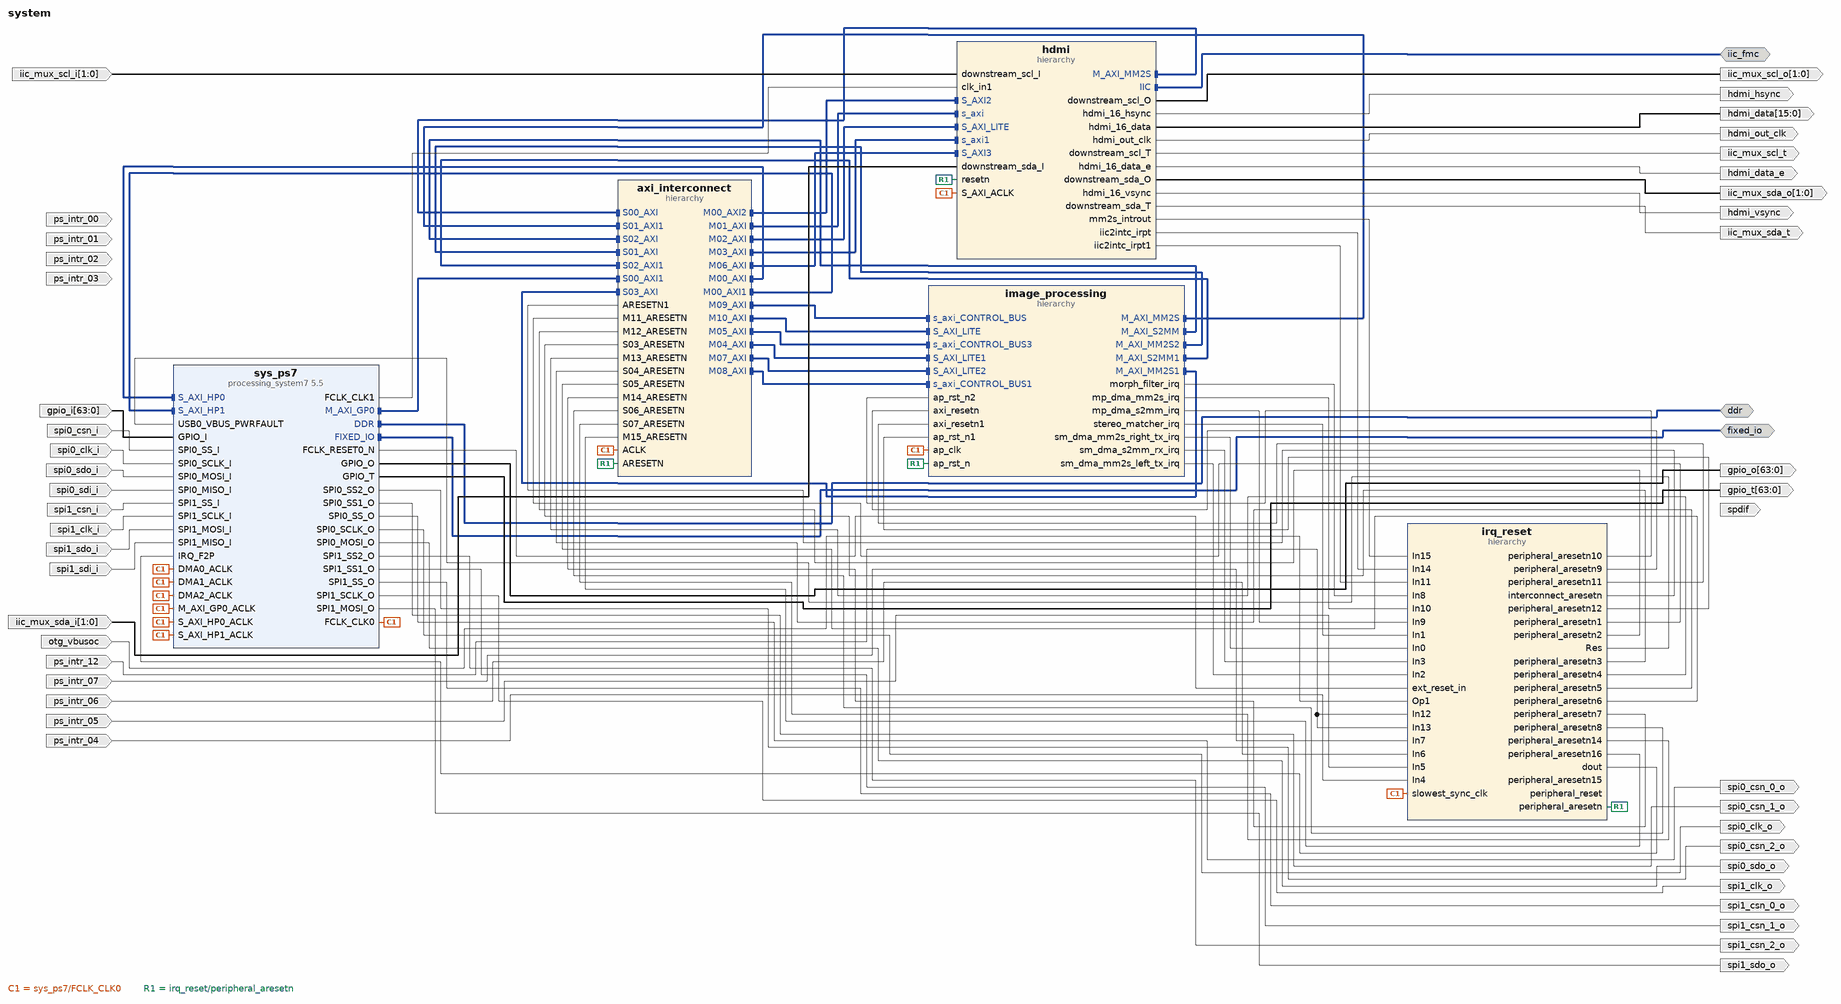
[diagram p0: block diagram of the top level]
# Vivado block design system, Vivado 2015.4
create_bd_design system

create_bd_intf_port -mode Master -vlnv xilinx.com:interface:ddrx_rtl:1.0 ddr
create_bd_intf_port -mode Master -vlnv xilinx.com:display_processing_system7:fixedio_rtl:1.0 fixed_io
create_bd_intf_port -mode Master -vlnv xilinx.com:interface:iic_rtl:1.0 iic_fmc
create_bd_port -dir I -type intr ps_intr_03
create_bd_port -dir I -type intr ps_intr_02
create_bd_port -dir I -type intr ps_intr_01
create_bd_port -dir I -type intr ps_intr_00
create_bd_port -dir I -from 63 -to 0 gpio_i
create_bd_port -dir O -from 63 -to 0 gpio_o
create_bd_port -dir O -from 63 -to 0 gpio_t
create_bd_port -dir I -from 1 -to 0 iic_mux_scl_i
create_bd_port -dir O -from 1 -to 0 iic_mux_scl_o
create_bd_port -dir O iic_mux_scl_t
create_bd_port -dir I -from 1 -to 0 iic_mux_sda_i
create_bd_port -dir O -from 1 -to 0 iic_mux_sda_o
create_bd_port -dir O iic_mux_sda_t
create_bd_port -dir I otg_vbusoc
create_bd_port -dir O spi0_csn_2_o
create_bd_port -dir O spi0_csn_1_o
create_bd_port -dir O spi0_csn_0_o
create_bd_port -dir I spi0_csn_i
create_bd_port -dir I spi0_clk_i
create_bd_port -dir O spi0_clk_o
create_bd_port -dir I spi0_sdo_i
create_bd_port -dir O spi0_sdo_o
create_bd_port -dir I spi0_sdi_i
create_bd_port -dir O spi1_csn_2_o
create_bd_port -dir O spi1_csn_1_o
create_bd_port -dir O spi1_csn_0_o
create_bd_port -dir I spi1_csn_i
create_bd_port -dir I spi1_clk_i
create_bd_port -dir O spi1_clk_o
create_bd_port -dir I spi1_sdo_i
create_bd_port -dir O spi1_sdo_o
create_bd_port -dir I spi1_sdi_i
create_bd_port -dir O hdmi_out_clk
create_bd_port -dir O hdmi_hsync
create_bd_port -dir O hdmi_vsync
create_bd_port -dir O hdmi_data_e
create_bd_port -dir O -from 15 -to 0 hdmi_data
create_bd_port -dir O spdif
create_bd_port -dir I -type intr ps_intr_12
create_bd_port -dir I -type intr ps_intr_07
create_bd_port -dir I -type intr ps_intr_06
create_bd_port -dir I -type intr ps_intr_05
create_bd_port -dir I -type intr ps_intr_04

create_bd_cell -type ip -vlnv xilinx.com:ip:processing_system7:5.5 sys_ps7
set_property -dict [list \
  CONFIG.PCW_FPGA0_PERIPHERAL_FREQMHZ 100.0 \
  CONFIG.PCW_FPGA1_PERIPHERAL_FREQMHZ 200.0 \
  CONFIG.PCW_USE_S_AXI_HP0 1 \
  CONFIG.PCW_USE_S_AXI_HP1 1 \
  CONFIG.PCW_USE_DMA0 1 \
  CONFIG.PCW_USE_DMA1 1 \
  CONFIG.PCW_USE_DMA2 1 \
  CONFIG.PCW_USE_FABRIC_INTERRUPT 1 \
  CONFIG.PCW_EN_CLK1_PORT 1 \
  CONFIG.PCW_EN_RST1_PORT 1 \
  CONFIG.PCW_IRQ_F2P_INTR 1 \
  CONFIG.PCW_IRQ_F2P_MODE REVERSE \
  CONFIG.PCW_IMPORT_BOARD_PRESET ZedBoard \
  CONFIG.PCW_SPI0_PERIPHERAL_ENABLE 1 \
  CONFIG.PCW_SPI0_SPI0_IO EMIO \
  CONFIG.PCW_SPI1_PERIPHERAL_ENABLE 1 \
  CONFIG.PCW_SPI1_SPI1_IO EMIO \
  CONFIG.PCW_GPIO_EMIO_GPIO_ENABLE 1 \
  CONFIG.PCW_GPIO_EMIO_GPIO_IO 64 \
] [get_bd_cells sys_ps7]
# 2 more settings of sys_ps7 are not shown: defaults, MIO pin electricals, DDR timing, and values the tool derives
create_bd_cell -type hier image_processing
create_bd_cell -type hier axi_interconnect
create_bd_cell -type hier irq_reset
create_bd_cell -type hier hdmi

# ---- hierarchy /image_processing ----
current_bd_instance /image_processing
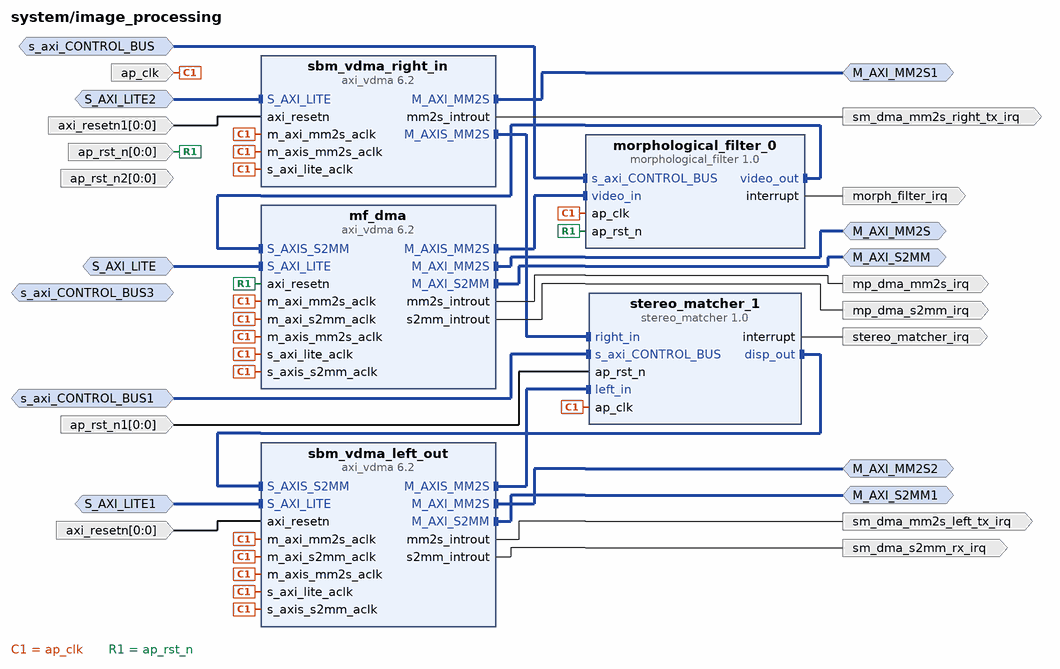
[diagram p1: block diagram inside /image_processing]
create_bd_intf_pin -mode Slave -vlnv xilinx.com:interface:aximm_rtl:1.0 S_AXI_LITE
create_bd_intf_pin -mode Master -vlnv xilinx.com:interface:aximm_rtl:1.0 M_AXI_MM2S
create_bd_intf_pin -mode Master -vlnv xilinx.com:interface:aximm_rtl:1.0 M_AXI_S2MM
create_bd_intf_pin -mode Slave -vlnv xilinx.com:interface:aximm_rtl:1.0 s_axi_CONTROL_BUS
create_bd_intf_pin -mode Slave -vlnv xilinx.com:interface:aximm_rtl:1.0 s_axi_CONTROL_BUS3
create_bd_intf_pin -mode Slave -vlnv xilinx.com:interface:aximm_rtl:1.0 S_AXI_LITE1
create_bd_intf_pin -mode Master -vlnv xilinx.com:interface:aximm_rtl:1.0 M_AXI_MM2S2
create_bd_intf_pin -mode Master -vlnv xilinx.com:interface:aximm_rtl:1.0 M_AXI_S2MM1
create_bd_intf_pin -mode Slave -vlnv xilinx.com:interface:aximm_rtl:1.0 S_AXI_LITE2
create_bd_intf_pin -mode Master -vlnv xilinx.com:interface:aximm_rtl:1.0 M_AXI_MM2S1
create_bd_intf_pin -mode Slave -vlnv xilinx.com:interface:aximm_rtl:1.0 s_axi_CONTROL_BUS1
create_bd_pin -dir I -type clk ap_clk
create_bd_pin -dir I -from 0 -to 0 -type rst ap_rst_n
create_bd_pin -dir O -type intr mp_dma_mm2s_irq
create_bd_pin -dir O -type intr mp_dma_s2mm_irq
create_bd_pin -dir O -type intr morph_filter_irq
create_bd_pin -dir O -type intr stereo_matcher_irq
create_bd_pin -dir O -type intr sm_dma_mm2s_right_tx_irq
create_bd_pin -dir O -type intr sm_dma_s2mm_rx_irq
create_bd_pin -dir O -type intr sm_dma_mm2s_left_tx_irq
create_bd_pin -dir I -from 0 -to 0 ap_rst_n2
create_bd_pin -dir I -from 0 -to 0 axi_resetn
create_bd_pin -dir I -from 0 -to 0 axi_resetn1
create_bd_pin -dir I -from 0 -to 0 ap_rst_n1

create_bd_cell -type ip -vlnv xilinx.com:ip:axi_vdma:6.2 mf_dma
set_property -dict [list \
  CONFIG.c_m_axi_mm2s_data_width 32 \
  CONFIG.c_m_axis_mm2s_tdata_width 8 \
  CONFIG.c_include_s2mm_dre 0 \
  CONFIG.c_use_s2mm_fsync 0 \
  CONFIG.c_mm2s_linebuffer_depth 512 \
  CONFIG.c_mm2s_max_burst_length 8 \
  CONFIG.c_include_mm2s_dre 0 \
] [get_bd_cells mf_dma]
create_bd_cell -type ip -vlnv xilinx.com:hls:morphological_filter:1.0 morphological_filter_0
create_bd_cell -type ip -vlnv xilinx.com:ip:axi_vdma:6.2 sbm_vdma_left_out
set_property -dict [list \
  CONFIG.c_m_axi_mm2s_data_width 32 \
  CONFIG.c_m_axis_mm2s_tdata_width 8 \
  CONFIG.c_include_s2mm_dre 1 \
  CONFIG.c_use_s2mm_fsync 0 \
  CONFIG.c_mm2s_max_burst_length 16 \
  CONFIG.c_s2mm_max_burst_length 256 \
] [get_bd_cells sbm_vdma_left_out]
create_bd_cell -type ip -vlnv xilinx.com:ip:axi_vdma:6.2 sbm_vdma_right_in
set_property -dict [list \
  CONFIG.c_m_axi_mm2s_data_width 32 \
  CONFIG.c_m_axis_mm2s_tdata_width 8 \
  CONFIG.c_mm2s_max_burst_length 16 \
  CONFIG.c_include_s2mm 0 \
] [get_bd_cells sbm_vdma_right_in]
create_bd_cell -type ip -vlnv xilinx.com:hls:stereo_matcher:1.0 stereo_matcher_1

# ---- hierarchy /axi_interconnect ----
current_bd_instance /axi_interconnect
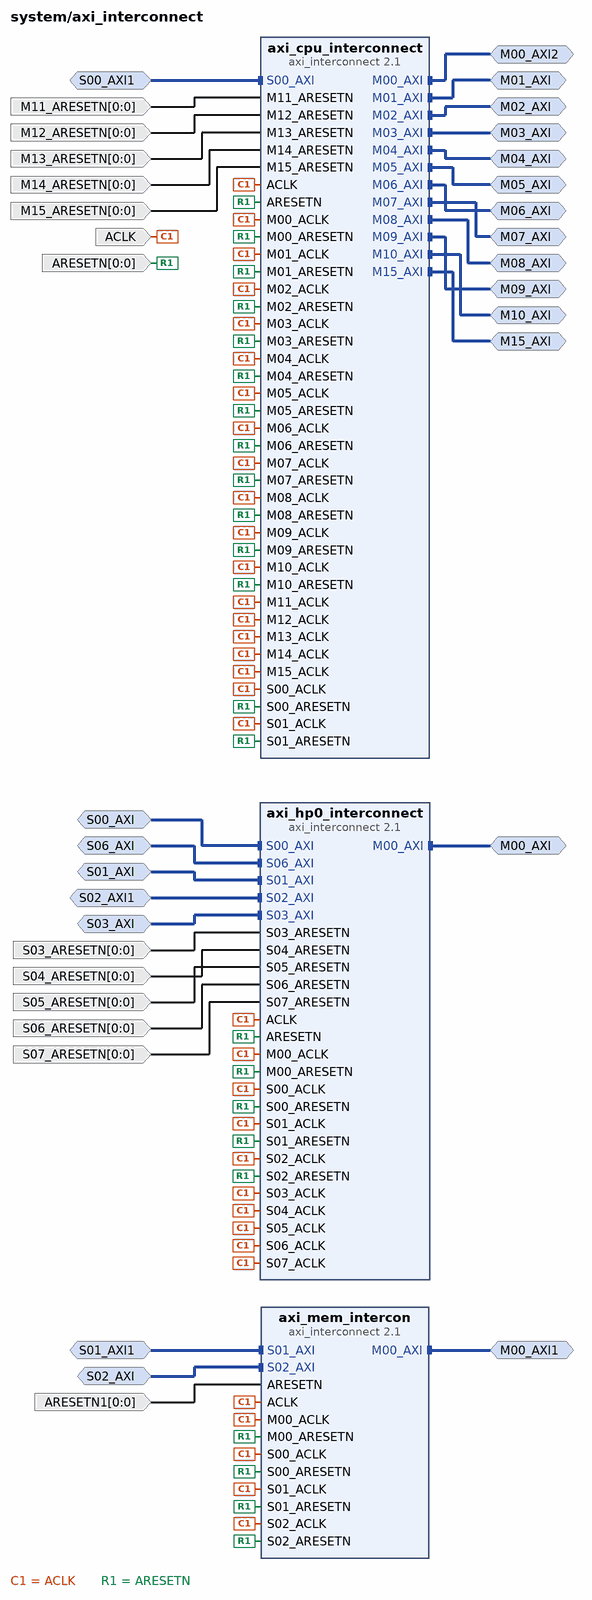
[diagram p2: block diagram inside /axi_interconnect]
create_bd_intf_pin -mode Slave -vlnv xilinx.com:interface:aximm_rtl:1.0 S00_AXI
create_bd_intf_pin -mode Master -vlnv xilinx.com:interface:aximm_rtl:1.0 M00_AXI
create_bd_intf_pin -mode Master -vlnv xilinx.com:interface:aximm_rtl:1.0 M00_AXI1
create_bd_intf_pin -mode Slave -vlnv xilinx.com:interface:aximm_rtl:1.0 S01_AXI1
create_bd_intf_pin -mode Slave -vlnv xilinx.com:interface:aximm_rtl:1.0 S02_AXI
create_bd_intf_pin -mode Slave -vlnv xilinx.com:interface:aximm_rtl:1.0 S00_AXI1
create_bd_intf_pin -mode Master -vlnv xilinx.com:interface:aximm_rtl:1.0 M00_AXI2
create_bd_intf_pin -mode Master -vlnv xilinx.com:interface:aximm_rtl:1.0 M01_AXI
create_bd_intf_pin -mode Master -vlnv xilinx.com:interface:aximm_rtl:1.0 M02_AXI
create_bd_intf_pin -mode Master -vlnv xilinx.com:interface:aximm_rtl:1.0 M03_AXI
create_bd_intf_pin -mode Master -vlnv xilinx.com:interface:aximm_rtl:1.0 M06_AXI
create_bd_intf_pin -mode Master -vlnv xilinx.com:interface:aximm_rtl:1.0 M09_AXI
create_bd_intf_pin -mode Master -vlnv xilinx.com:interface:aximm_rtl:1.0 M10_AXI
create_bd_intf_pin -mode Slave -vlnv xilinx.com:interface:aximm_rtl:1.0 S06_AXI
create_bd_intf_pin -mode Master -vlnv xilinx.com:interface:aximm_rtl:1.0 M05_AXI
create_bd_intf_pin -mode Master -vlnv xilinx.com:interface:aximm_rtl:1.0 M15_AXI
create_bd_intf_pin -mode Master -vlnv xilinx.com:interface:aximm_rtl:1.0 M04_AXI
create_bd_intf_pin -mode Slave -vlnv xilinx.com:interface:aximm_rtl:1.0 S01_AXI
create_bd_intf_pin -mode Slave -vlnv xilinx.com:interface:aximm_rtl:1.0 S02_AXI1
create_bd_intf_pin -mode Master -vlnv xilinx.com:interface:aximm_rtl:1.0 M07_AXI
create_bd_intf_pin -mode Slave -vlnv xilinx.com:interface:aximm_rtl:1.0 S03_AXI
create_bd_intf_pin -mode Master -vlnv xilinx.com:interface:aximm_rtl:1.0 M08_AXI
create_bd_pin -dir I -type clk ACLK
create_bd_pin -dir I -from 0 -to 0 -type rst ARESETN
create_bd_pin -dir I -from 0 -to 0 -type rst ARESETN1
create_bd_pin -dir I -from 0 -to 0 M11_ARESETN
create_bd_pin -dir I -from 0 -to 0 M12_ARESETN
create_bd_pin -dir I -from 0 -to 0 S03_ARESETN
create_bd_pin -dir I -from 0 -to 0 M13_ARESETN
create_bd_pin -dir I -from 0 -to 0 S04_ARESETN
create_bd_pin -dir I -from 0 -to 0 S05_ARESETN
create_bd_pin -dir I -from 0 -to 0 M14_ARESETN
create_bd_pin -dir I -from 0 -to 0 S06_ARESETN
create_bd_pin -dir I -from 0 -to 0 S07_ARESETN
create_bd_pin -dir I -from 0 -to 0 M15_ARESETN

create_bd_cell -type ip -vlnv xilinx.com:ip:axi_interconnect:2.1 axi_hp0_interconnect
set_property -dict {CONFIG.NUM_SI 8 CONFIG.NUM_MI 1} [get_bd_cells axi_hp0_interconnect]
create_bd_cell -type ip -vlnv xilinx.com:ip:axi_interconnect:2.1 axi_mem_intercon
set_property -dict {CONFIG.NUM_SI 3 CONFIG.NUM_MI 1} [get_bd_cells axi_mem_intercon]
create_bd_cell -type ip -vlnv xilinx.com:ip:axi_interconnect:2.1 axi_cpu_interconnect
set_property -dict {CONFIG.NUM_SI 2 CONFIG.NUM_MI 16} [get_bd_cells axi_cpu_interconnect]

# ---- hierarchy /irq_reset ----
current_bd_instance /irq_reset
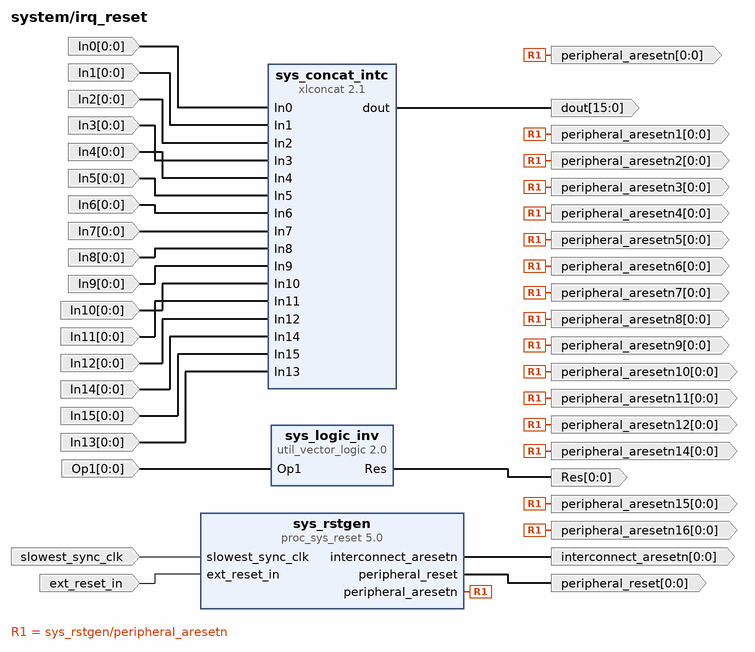
[diagram p3: block diagram inside /irq_reset]
create_bd_pin -dir I -from 0 -to 0 In0
create_bd_pin -dir I -from 0 -to 0 In1
create_bd_pin -dir I -from 0 -to 0 In2
create_bd_pin -dir I -from 0 -to 0 In3
create_bd_pin -dir I -from 0 -to 0 In4
create_bd_pin -dir I -from 0 -to 0 In5
create_bd_pin -dir I -from 0 -to 0 In6
create_bd_pin -dir I -from 0 -to 0 In7
create_bd_pin -dir I -from 0 -to 0 In8
create_bd_pin -dir I -from 0 -to 0 In9
create_bd_pin -dir I -from 0 -to 0 In10
create_bd_pin -dir I -from 0 -to 0 In11
create_bd_pin -dir I -from 0 -to 0 In12
create_bd_pin -dir I -from 0 -to 0 In14
create_bd_pin -dir I -from 0 -to 0 In15
create_bd_pin -dir O -from 15 -to 0 dout
create_bd_pin -dir I -type clk slowest_sync_clk
create_bd_pin -dir I -type rst ext_reset_in
create_bd_pin -dir O -from 0 -to 0 -type rst peripheral_reset
create_bd_pin -dir O -from 0 -to 0 -type rst interconnect_aresetn
create_bd_pin -dir O -from 0 -to 0 -type rst peripheral_aresetn
create_bd_pin -dir I -from 0 -to 0 Op1
create_bd_pin -dir O -from 0 -to 0 Res
create_bd_pin -dir O -from 0 -to 0 peripheral_aresetn1
create_bd_pin -dir O -from 0 -to 0 peripheral_aresetn2
create_bd_pin -dir O -from 0 -to 0 peripheral_aresetn3
create_bd_pin -dir O -from 0 -to 0 peripheral_aresetn4
create_bd_pin -dir O -from 0 -to 0 peripheral_aresetn5
create_bd_pin -dir O -from 0 -to 0 peripheral_aresetn6
create_bd_pin -dir O -from 0 -to 0 peripheral_aresetn7
create_bd_pin -dir O -from 0 -to 0 peripheral_aresetn8
create_bd_pin -dir I -from 0 -to 0 In13
create_bd_pin -dir O -from 0 -to 0 peripheral_aresetn10
create_bd_pin -dir O -from 0 -to 0 peripheral_aresetn14
create_bd_pin -dir O -from 0 -to 0 peripheral_aresetn15
create_bd_pin -dir O -from 0 -to 0 peripheral_aresetn16
create_bd_pin -dir O -from 0 -to 0 peripheral_aresetn9
create_bd_pin -dir O -from 0 -to 0 peripheral_aresetn11
create_bd_pin -dir O -from 0 -to 0 peripheral_aresetn12

create_bd_cell -type ip -vlnv xilinx.com:ip:xlconcat:2.1 sys_concat_intc
set_property -dict {CONFIG.NUM_PORTS 16} [get_bd_cells sys_concat_intc]
create_bd_cell -type ip -vlnv xilinx.com:ip:proc_sys_reset:5.0 sys_rstgen
set_property -dict {CONFIG.C_EXT_RST_WIDTH 1} [get_bd_cells sys_rstgen]
create_bd_cell -type ip -vlnv xilinx.com:ip:util_vector_logic:2.0 sys_logic_inv
set_property -dict {CONFIG.C_SIZE 1 CONFIG.C_OPERATION not} [get_bd_cells sys_logic_inv]

# ---- hierarchy /hdmi ----
current_bd_instance /hdmi
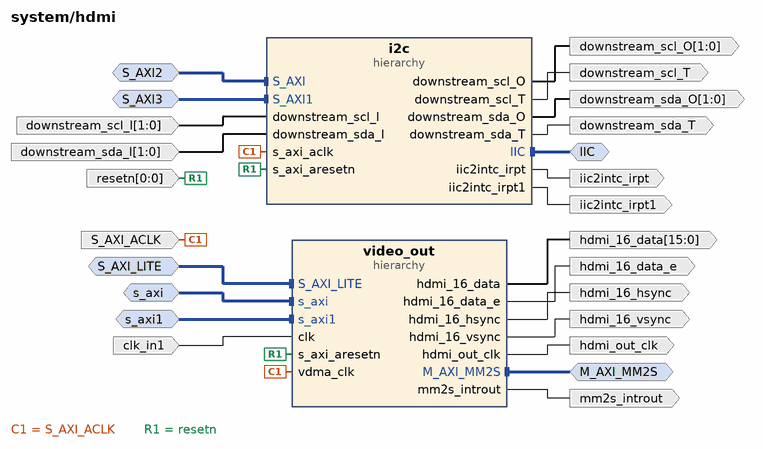
[diagram p4: block diagram inside /hdmi]
create_bd_intf_pin -mode Slave -vlnv xilinx.com:interface:aximm_rtl:1.0 S_AXI_LITE
create_bd_intf_pin -mode Master -vlnv xilinx.com:interface:aximm_rtl:1.0 M_AXI_MM2S
create_bd_intf_pin -mode Slave -vlnv xilinx.com:interface:aximm_rtl:1.0 s_axi
create_bd_intf_pin -mode Slave -vlnv xilinx.com:interface:aximm_rtl:1.0 s_axi1
create_bd_intf_pin -mode Slave -vlnv xilinx.com:interface:aximm_rtl:1.0 S_AXI2
create_bd_intf_pin -mode Slave -vlnv xilinx.com:interface:aximm_rtl:1.0 S_AXI3
create_bd_intf_pin -mode Master -vlnv xilinx.com:interface:iic_rtl:1.0 IIC
create_bd_pin -dir I -type clk S_AXI_ACLK
create_bd_pin -dir I -from 0 -to 0 -type rst resetn
create_bd_pin -dir O -type intr mm2s_introut
create_bd_pin -dir I -type clk clk_in1
create_bd_pin -dir O hdmi_out_clk
create_bd_pin -dir O hdmi_16_hsync
create_bd_pin -dir O hdmi_16_vsync
create_bd_pin -dir O hdmi_16_data_e
create_bd_pin -dir O -from 15 -to 0 hdmi_16_data
create_bd_pin -dir O -type intr iic2intc_irpt
create_bd_pin -dir O downstream_scl_T
create_bd_pin -dir I -from 1 -to 0 downstream_scl_I
create_bd_pin -dir O -from 1 -to 0 downstream_scl_O
create_bd_pin -dir O downstream_sda_T
create_bd_pin -dir I -from 1 -to 0 downstream_sda_I
create_bd_pin -dir O -from 1 -to 0 downstream_sda_O
create_bd_pin -dir O -type intr iic2intc_irpt1

create_bd_cell -type hier video_out
create_bd_cell -type hier i2c

# ---- hierarchy /hdmi/video_out ----
current_bd_instance /hdmi/video_out
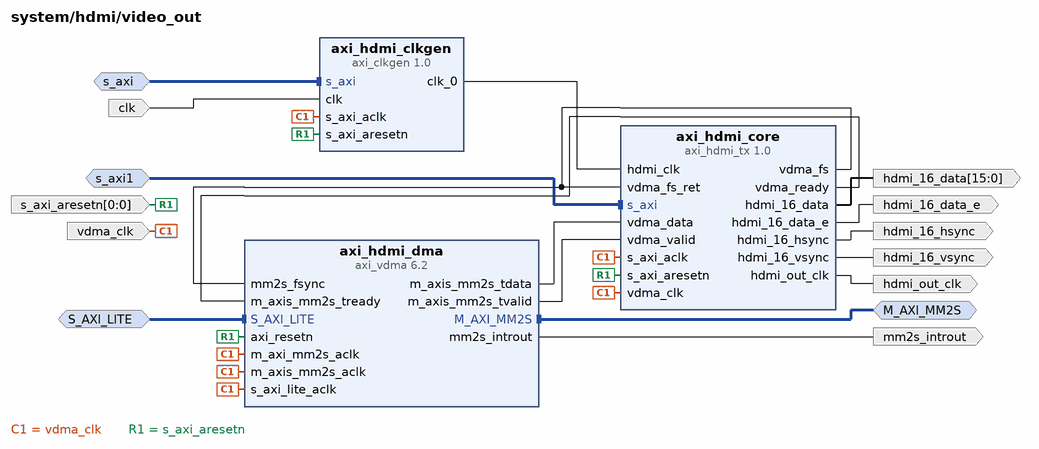
[diagram p5: block diagram inside /hdmi/video_out]
create_bd_intf_pin -mode Slave -vlnv xilinx.com:interface:aximm_rtl:1.0 S_AXI_LITE
create_bd_intf_pin -mode Master -vlnv xilinx.com:interface:aximm_rtl:1.0 M_AXI_MM2S
create_bd_intf_pin -mode Slave -vlnv xilinx.com:interface:aximm_rtl:1.0 s_axi
create_bd_intf_pin -mode Slave -vlnv xilinx.com:interface:aximm_rtl:1.0 s_axi1
create_bd_pin -dir I vdma_clk
create_bd_pin -dir I -from 0 -to 0 -type rst s_axi_aresetn
create_bd_pin -dir O -type intr mm2s_introut
create_bd_pin -dir I clk
create_bd_pin -dir O hdmi_out_clk
create_bd_pin -dir O hdmi_16_hsync
create_bd_pin -dir O hdmi_16_vsync
create_bd_pin -dir O hdmi_16_data_e
create_bd_pin -dir O -from 15 -to 0 hdmi_16_data

create_bd_cell -type ip -vlnv xilinx.com:ip:axi_vdma:6.2 axi_hdmi_dma
set_property -dict [list \
  CONFIG.c_m_axis_mm2s_tdata_width 64 \
  CONFIG.c_use_mm2s_fsync 1 \
  CONFIG.c_include_s2mm 0 \
] [get_bd_cells axi_hdmi_dma]
create_bd_cell -type ip -vlnv analog.com:user:axi_clkgen:1.0 axi_hdmi_clkgen
create_bd_cell -type ip -vlnv analog.com:user:axi_hdmi_tx:1.0 axi_hdmi_core

# ---- hierarchy /hdmi/i2c ----
current_bd_instance /hdmi/i2c
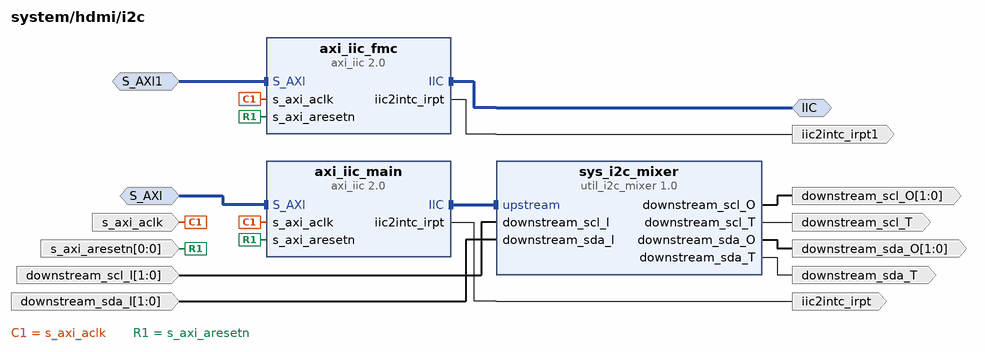
[diagram p6: block diagram inside /hdmi/i2c]
create_bd_intf_pin -mode Slave -vlnv xilinx.com:interface:aximm_rtl:1.0 S_AXI
create_bd_intf_pin -mode Slave -vlnv xilinx.com:interface:aximm_rtl:1.0 S_AXI1
create_bd_intf_pin -mode Master -vlnv xilinx.com:interface:iic_rtl:1.0 IIC
create_bd_pin -dir I -type clk s_axi_aclk
create_bd_pin -dir I -from 0 -to 0 -type rst s_axi_aresetn
create_bd_pin -dir O -type intr iic2intc_irpt
create_bd_pin -dir O downstream_scl_T
create_bd_pin -dir I -from 1 -to 0 downstream_scl_I
create_bd_pin -dir O -from 1 -to 0 downstream_scl_O
create_bd_pin -dir O downstream_sda_T
create_bd_pin -dir I -from 1 -to 0 downstream_sda_I
create_bd_pin -dir O -from 1 -to 0 downstream_sda_O
create_bd_pin -dir O -type intr iic2intc_irpt1

create_bd_cell -type ip -vlnv xilinx.com:ip:axi_iic:2.0 axi_iic_main
set_property -dict {CONFIG.USE_BOARD_FLOW true CONFIG.IIC_BOARD_INTERFACE Custom} [get_bd_cells axi_iic_main]
create_bd_cell -type ip -vlnv analog.com:user:util_i2c_mixer:1.0 sys_i2c_mixer
create_bd_cell -type ip -vlnv xilinx.com:ip:axi_iic:2.0 axi_iic_fmc

# ---- connections ----

current_bd_instance /image_processing
connect_bd_intf_net -intf_net axi_vdma_0_M_AXIS_MM2S [get_bd_intf_pins morphological_filter_0/video_in] [get_bd_intf_pins mf_dma/M_AXIS_MM2S]
connect_bd_intf_net [get_bd_intf_pins morphological_filter_0/video_out] [get_bd_intf_pins mf_dma/S_AXIS_S2MM]
connect_bd_intf_net [get_bd_intf_pins stereo_matcher_1/disp_out] [get_bd_intf_pins sbm_vdma_left_out/S_AXIS_S2MM]
connect_bd_intf_net [get_bd_intf_pins stereo_matcher_1/left_in] [get_bd_intf_pins sbm_vdma_left_out/M_AXIS_MM2S]
connect_bd_intf_net [get_bd_intf_pins stereo_matcher_1/right_in] [get_bd_intf_pins sbm_vdma_right_in/M_AXIS_MM2S]
connect_bd_intf_net -intf_net axi_cpu_interconnect_M10_AXI [get_bd_intf_pins S_AXI_LITE] [get_bd_intf_pins mf_dma/S_AXI_LITE]
connect_bd_intf_net -intf_net axi_vdma_0_M_AXI_MM2S [get_bd_intf_pins M_AXI_MM2S] [get_bd_intf_pins mf_dma/M_AXI_MM2S]
connect_bd_intf_net -intf_net axi_vdma_0_M_AXI_S2MM [get_bd_intf_pins M_AXI_S2MM] [get_bd_intf_pins mf_dma/M_AXI_S2MM]
connect_bd_intf_net -intf_net axi_cpu_interconnect_M09_AXI [get_bd_intf_pins s_axi_CONTROL_BUS] [get_bd_intf_pins morphological_filter_0/s_axi_CONTROL_BUS]
connect_bd_intf_net -intf_net S_AXI_LITE1_1 [get_bd_intf_pins S_AXI_LITE1] [get_bd_intf_pins sbm_vdma_left_out/S_AXI_LITE]
connect_bd_intf_net [get_bd_intf_pins M_AXI_MM2S2] [get_bd_intf_pins sbm_vdma_left_out/M_AXI_MM2S]
connect_bd_intf_net [get_bd_intf_pins M_AXI_S2MM1] [get_bd_intf_pins sbm_vdma_left_out/M_AXI_S2MM]
connect_bd_intf_net -intf_net S_AXI_LITE2_1 [get_bd_intf_pins S_AXI_LITE2] [get_bd_intf_pins sbm_vdma_right_in/S_AXI_LITE]
connect_bd_intf_net [get_bd_intf_pins M_AXI_MM2S1] [get_bd_intf_pins sbm_vdma_right_in/M_AXI_MM2S]
connect_bd_intf_net -intf_net s_axi_CONTROL_BUS1_1 [get_bd_intf_pins s_axi_CONTROL_BUS1] [get_bd_intf_pins stereo_matcher_1/s_axi_CONTROL_BUS]
connect_bd_net -net sys_cpu_clk [get_bd_pins ap_clk] \
  [get_bd_pins mf_dma/m_axi_mm2s_aclk] [get_bd_pins mf_dma/m_axi_s2mm_aclk] [get_bd_pins mf_dma/s_axis_s2mm_aclk] \
  [get_bd_pins mf_dma/m_axis_mm2s_aclk] [get_bd_pins morphological_filter_0/ap_clk] [get_bd_pins mf_dma/s_axi_lite_aclk] \
  [get_bd_pins sbm_vdma_left_out/s_axi_lite_aclk] [get_bd_pins sbm_vdma_left_out/m_axi_mm2s_aclk] \
  [get_bd_pins sbm_vdma_left_out/m_axis_mm2s_aclk] [get_bd_pins sbm_vdma_left_out/m_axi_s2mm_aclk] \
  [get_bd_pins sbm_vdma_left_out/s_axis_s2mm_aclk] [get_bd_pins sbm_vdma_right_in/s_axi_lite_aclk] \
  [get_bd_pins sbm_vdma_right_in/m_axi_mm2s_aclk] [get_bd_pins sbm_vdma_right_in/m_axis_mm2s_aclk] \
  [get_bd_pins stereo_matcher_1/ap_clk]
connect_bd_net -net sys_cpu_resetn [get_bd_pins ap_rst_n] [get_bd_pins morphological_filter_0/ap_rst_n] [get_bd_pins mf_dma/axi_resetn]
connect_bd_net -net axi_vdma_0_mm2s_introut [get_bd_pins mf_dma/mm2s_introut] [get_bd_pins mp_dma_mm2s_irq]
connect_bd_net -net axi_vdma_0_s2mm_introut [get_bd_pins mf_dma/s2mm_introut] [get_bd_pins mp_dma_s2mm_irq]
connect_bd_net [get_bd_pins morphological_filter_0/interrupt] [get_bd_pins morph_filter_irq]
connect_bd_net -net axi_vdma_0_mm2s_introut1 [get_bd_pins sbm_vdma_left_out/mm2s_introut] [get_bd_pins sm_dma_mm2s_left_tx_irq]
connect_bd_net -net axi_vdma_0_s2mm_introut1 [get_bd_pins sbm_vdma_left_out/s2mm_introut] [get_bd_pins sm_dma_s2mm_rx_irq]
connect_bd_net [get_bd_pins axi_resetn] [get_bd_pins sbm_vdma_left_out/axi_resetn]
connect_bd_net -net axi_vdma_0_mm2s_introut2 [get_bd_pins sbm_vdma_right_in/mm2s_introut] [get_bd_pins sm_dma_mm2s_right_tx_irq]
connect_bd_net -net axi_resetn1_1 [get_bd_pins axi_resetn1] [get_bd_pins sbm_vdma_right_in/axi_resetn]
connect_bd_net -net ap_rst_n1_1 [get_bd_pins ap_rst_n1] [get_bd_pins stereo_matcher_1/ap_rst_n]
connect_bd_net [get_bd_pins stereo_matcher_1/interrupt] [get_bd_pins stereo_matcher_irq]

current_bd_instance /axi_interconnect
connect_bd_intf_net [get_bd_intf_pins S00_AXI] [get_bd_intf_pins axi_hp0_interconnect/S00_AXI]
connect_bd_intf_net [get_bd_intf_pins M00_AXI] [get_bd_intf_pins axi_hp0_interconnect/M00_AXI]
connect_bd_intf_net [get_bd_intf_pins M00_AXI1] [get_bd_intf_pins axi_mem_intercon/M00_AXI]
connect_bd_intf_net -intf_net axi_vdma_0_M_AXI_MM2S [get_bd_intf_pins S01_AXI1] [get_bd_intf_pins axi_mem_intercon/S01_AXI]
connect_bd_intf_net -intf_net axi_vdma_0_M_AXI_S2MM [get_bd_intf_pins S02_AXI] [get_bd_intf_pins axi_mem_intercon/S02_AXI]
connect_bd_intf_net [get_bd_intf_pins S00_AXI1] [get_bd_intf_pins axi_cpu_interconnect/S00_AXI]
connect_bd_intf_net [get_bd_intf_pins M00_AXI2] [get_bd_intf_pins axi_cpu_interconnect/M00_AXI]
connect_bd_intf_net [get_bd_intf_pins M01_AXI] [get_bd_intf_pins axi_cpu_interconnect/M01_AXI]
connect_bd_intf_net [get_bd_intf_pins M02_AXI] [get_bd_intf_pins axi_cpu_interconnect/M02_AXI]
connect_bd_intf_net [get_bd_intf_pins M03_AXI] [get_bd_intf_pins axi_cpu_interconnect/M03_AXI]
connect_bd_intf_net [get_bd_intf_pins M06_AXI] [get_bd_intf_pins axi_cpu_interconnect/M06_AXI]
connect_bd_intf_net [get_bd_intf_pins M09_AXI] [get_bd_intf_pins axi_cpu_interconnect/M09_AXI]
connect_bd_intf_net [get_bd_intf_pins M10_AXI] [get_bd_intf_pins axi_cpu_interconnect/M10_AXI]
connect_bd_intf_net [get_bd_intf_pins S06_AXI] [get_bd_intf_pins axi_hp0_interconnect/S06_AXI]
connect_bd_intf_net [get_bd_intf_pins M05_AXI] [get_bd_intf_pins axi_cpu_interconnect/M05_AXI]
connect_bd_intf_net [get_bd_intf_pins M15_AXI] [get_bd_intf_pins axi_cpu_interconnect/M15_AXI]
connect_bd_intf_net [get_bd_intf_pins M04_AXI] [get_bd_intf_pins axi_cpu_interconnect/M04_AXI]
connect_bd_intf_net [get_bd_intf_pins S01_AXI] [get_bd_intf_pins axi_hp0_interconnect/S01_AXI]
connect_bd_intf_net -intf_net S02_AXI1_1 [get_bd_intf_pins S02_AXI1] [get_bd_intf_pins axi_hp0_interconnect/S02_AXI]
connect_bd_intf_net [get_bd_intf_pins M07_AXI] [get_bd_intf_pins axi_cpu_interconnect/M07_AXI]
connect_bd_intf_net [get_bd_intf_pins S03_AXI] [get_bd_intf_pins axi_hp0_interconnect/S03_AXI]
connect_bd_intf_net [get_bd_intf_pins M08_AXI] [get_bd_intf_pins axi_cpu_interconnect/M08_AXI]
connect_bd_net -net sys_cpu_clk [get_bd_pins ACLK] \
  [get_bd_pins axi_cpu_interconnect/ACLK] [get_bd_pins axi_cpu_interconnect/S00_ACLK] \
  [get_bd_pins axi_cpu_interconnect/M00_ACLK] [get_bd_pins axi_cpu_interconnect/M01_ACLK] \
  [get_bd_pins axi_cpu_interconnect/M02_ACLK] [get_bd_pins axi_cpu_interconnect/M03_ACLK] \
  [get_bd_pins axi_cpu_interconnect/M04_ACLK] [get_bd_pins axi_cpu_interconnect/M05_ACLK] \
  [get_bd_pins axi_cpu_interconnect/M06_ACLK] [get_bd_pins axi_hp0_interconnect/M00_ACLK] \
  [get_bd_pins axi_hp0_interconnect/S00_ACLK] [get_bd_pins axi_cpu_interconnect/M07_ACLK] \
  [get_bd_pins axi_cpu_interconnect/M08_ACLK] [get_bd_pins axi_cpu_interconnect/S01_ACLK] \
  [get_bd_pins axi_hp0_interconnect/S01_ACLK] [get_bd_pins axi_cpu_interconnect/M09_ACLK] \
  [get_bd_pins axi_cpu_interconnect/M10_ACLK] [get_bd_pins axi_mem_intercon/S00_ACLK] [get_bd_pins axi_mem_intercon/ACLK] \
  [get_bd_pins axi_mem_intercon/M00_ACLK] [get_bd_pins axi_hp0_interconnect/S02_ACLK] [get_bd_pins axi_mem_intercon/S01_ACLK] \
  [get_bd_pins axi_mem_intercon/S02_ACLK] [get_bd_pins axi_hp0_interconnect/ACLK] [get_bd_pins axi_cpu_interconnect/M11_ACLK] \
  [get_bd_pins axi_cpu_interconnect/M12_ACLK] [get_bd_pins axi_hp0_interconnect/S03_ACLK] \
  [get_bd_pins axi_cpu_interconnect/M13_ACLK] [get_bd_pins axi_hp0_interconnect/S04_ACLK] \
  [get_bd_pins axi_hp0_interconnect/S05_ACLK] [get_bd_pins axi_cpu_interconnect/M14_ACLK] \
  [get_bd_pins axi_hp0_interconnect/S06_ACLK] [get_bd_pins axi_hp0_interconnect/S07_ACLK] \
  [get_bd_pins axi_cpu_interconnect/M15_ACLK]
connect_bd_net -net sys_cpu_resetn [get_bd_pins ARESETN] \
  [get_bd_pins axi_cpu_interconnect/ARESETN] [get_bd_pins axi_cpu_interconnect/S00_ARESETN] \
  [get_bd_pins axi_cpu_interconnect/M00_ARESETN] [get_bd_pins axi_cpu_interconnect/M01_ARESETN] \
  [get_bd_pins axi_cpu_interconnect/M02_ARESETN] [get_bd_pins axi_cpu_interconnect/M03_ARESETN] \
  [get_bd_pins axi_cpu_interconnect/M04_ARESETN] [get_bd_pins axi_cpu_interconnect/M05_ARESETN] \
  [get_bd_pins axi_cpu_interconnect/M06_ARESETN] [get_bd_pins axi_hp0_interconnect/M00_ARESETN] \
  [get_bd_pins axi_hp0_interconnect/S00_ARESETN] [get_bd_pins axi_cpu_interconnect/M07_ARESETN] \
  [get_bd_pins axi_cpu_interconnect/M08_ARESETN] [get_bd_pins axi_cpu_interconnect/S01_ARESETN] \
  [get_bd_pins axi_hp0_interconnect/S01_ARESETN] [get_bd_pins axi_cpu_interconnect/M09_ARESETN] \
  [get_bd_pins axi_cpu_interconnect/M10_ARESETN] [get_bd_pins axi_mem_intercon/S00_ARESETN] \
  [get_bd_pins axi_mem_intercon/M00_ARESETN] [get_bd_pins axi_hp0_interconnect/S02_ARESETN] \
  [get_bd_pins axi_mem_intercon/S01_ARESETN] [get_bd_pins axi_mem_intercon/S02_ARESETN] \
  [get_bd_pins axi_hp0_interconnect/ARESETN]
connect_bd_net -net sys_rstgen_interconnect_aresetn [get_bd_pins ARESETN1] [get_bd_pins axi_mem_intercon/ARESETN]
connect_bd_net [get_bd_pins M11_ARESETN] [get_bd_pins axi_cpu_interconnect/M11_ARESETN]
connect_bd_net [get_bd_pins M12_ARESETN] [get_bd_pins axi_cpu_interconnect/M12_ARESETN]
connect_bd_net [get_bd_pins S03_ARESETN] [get_bd_pins axi_hp0_interconnect/S03_ARESETN]
connect_bd_net [get_bd_pins M13_ARESETN] [get_bd_pins axi_cpu_interconnect/M13_ARESETN]
connect_bd_net [get_bd_pins S04_ARESETN] [get_bd_pins axi_hp0_interconnect/S04_ARESETN]
connect_bd_net [get_bd_pins S05_ARESETN] [get_bd_pins axi_hp0_interconnect/S05_ARESETN]
connect_bd_net [get_bd_pins M14_ARESETN] [get_bd_pins axi_cpu_interconnect/M14_ARESETN]
connect_bd_net [get_bd_pins S06_ARESETN] [get_bd_pins axi_hp0_interconnect/S06_ARESETN]
connect_bd_net [get_bd_pins S07_ARESETN] [get_bd_pins axi_hp0_interconnect/S07_ARESETN]
connect_bd_net [get_bd_pins M15_ARESETN] [get_bd_pins axi_cpu_interconnect/M15_ARESETN]

current_bd_instance /irq_reset
connect_bd_net -net ps_intr_00_1 [get_bd_pins In0] [get_bd_pins sys_concat_intc/In0]
connect_bd_net -net ps_intr_01_1 [get_bd_pins In1] [get_bd_pins sys_concat_intc/In1]
connect_bd_net -net ps_intr_02_1 [get_bd_pins In2] [get_bd_pins sys_concat_intc/In2]
connect_bd_net -net ps_intr_03_1 [get_bd_pins In3] [get_bd_pins sys_concat_intc/In3]
connect_bd_net -net ps_intr_04_1 [get_bd_pins In4] [get_bd_pins sys_concat_intc/In4]
connect_bd_net -net ps_intr_05_1 [get_bd_pins In5] [get_bd_pins sys_concat_intc/In5]
connect_bd_net -net ps_intr_06_1 [get_bd_pins In6] [get_bd_pins sys_concat_intc/In6]
connect_bd_net -net ps_intr_07_1 [get_bd_pins In7] [get_bd_pins sys_concat_intc/In7]
connect_bd_net -net morphological_filter_0_interrupt [get_bd_pins In8] [get_bd_pins sys_concat_intc/In8]
connect_bd_net -net axi_vdma_0_s2mm_introut [get_bd_pins In9] [get_bd_pins sys_concat_intc/In9]
connect_bd_net -net axi_vdma_0_mm2s_introut [get_bd_pins In10] [get_bd_pins sys_concat_intc/In10]
connect_bd_net -net axi_iic_fmc_iic2intc_irpt [get_bd_pins In11] [get_bd_pins sys_concat_intc/In11]
connect_bd_net -net ps_intr_12_1 [get_bd_pins In12] [get_bd_pins sys_concat_intc/In12]
connect_bd_net -net axi_iic_main_iic2intc_irpt [get_bd_pins In14] [get_bd_pins sys_concat_intc/In14]
connect_bd_net -net axi_hdmi_dma_mm2s_introut [get_bd_pins In15] [get_bd_pins sys_concat_intc/In15]
connect_bd_net [get_bd_pins sys_concat_intc/dout] [get_bd_pins dout]
connect_bd_net -net sys_cpu_clk [get_bd_pins slowest_sync_clk] [get_bd_pins sys_rstgen/slowest_sync_clk]
connect_bd_net -net sys_ps7_FCLK_RESET0_N [get_bd_pins ext_reset_in] [get_bd_pins sys_rstgen/ext_reset_in]
connect_bd_net -net sys_cpu_reset [get_bd_pins sys_rstgen/peripheral_reset] [get_bd_pins peripheral_reset]
connect_bd_net [get_bd_pins sys_rstgen/interconnect_aresetn] [get_bd_pins interconnect_aresetn]
connect_bd_net -net sys_cpu_resetn [get_bd_pins sys_rstgen/peripheral_aresetn] \
  [get_bd_pins peripheral_aresetn12] [get_bd_pins peripheral_aresetn10] [get_bd_pins peripheral_aresetn] \
  [get_bd_pins peripheral_aresetn1] [get_bd_pins peripheral_aresetn2] [get_bd_pins peripheral_aresetn3] \
  [get_bd_pins peripheral_aresetn4] [get_bd_pins peripheral_aresetn5] [get_bd_pins peripheral_aresetn6] \
  [get_bd_pins peripheral_aresetn7] [get_bd_pins peripheral_aresetn8] [get_bd_pins peripheral_aresetn14] \
  [get_bd_pins peripheral_aresetn15] [get_bd_pins peripheral_aresetn16] [get_bd_pins peripheral_aresetn9] \
  [get_bd_pins peripheral_aresetn11]
connect_bd_net -net otg_vbusoc_1 [get_bd_pins Op1] [get_bd_pins sys_logic_inv/Op1]
connect_bd_net [get_bd_pins sys_logic_inv/Res] [get_bd_pins Res]
connect_bd_net -net In13_1 [get_bd_pins In13] [get_bd_pins sys_concat_intc/In13]

current_bd_instance /hdmi
connect_bd_intf_net -intf_net axi_cpu_interconnect_M02_AXI [get_bd_intf_pins S_AXI_LITE] [get_bd_intf_pins video_out/S_AXI_LITE]
connect_bd_intf_net -intf_net S00_AXI_2 [get_bd_intf_pins M_AXI_MM2S] [get_bd_intf_pins video_out/M_AXI_MM2S]
connect_bd_intf_net -intf_net axi_cpu_interconnect_M01_AXI [get_bd_intf_pins s_axi] [get_bd_intf_pins video_out/s_axi]
connect_bd_intf_net -intf_net axi_cpu_interconnect_M03_AXI [get_bd_intf_pins s_axi1] [get_bd_intf_pins video_out/s_axi1]
connect_bd_intf_net -intf_net axi_cpu_interconnect_M00_AXI [get_bd_intf_pins S_AXI2] [get_bd_intf_pins i2c/S_AXI]
connect_bd_intf_net -intf_net axi_cpu_interconnect_M06_AXI [get_bd_intf_pins S_AXI3] [get_bd_intf_pins i2c/S_AXI1]
connect_bd_intf_net -intf_net axi_iic_fmc_IIC [get_bd_intf_pins IIC] [get_bd_intf_pins i2c/IIC]
connect_bd_net -net sys_cpu_clk [get_bd_pins S_AXI_ACLK] [get_bd_pins i2c/s_axi_aclk] [get_bd_pins video_out/vdma_clk]
connect_bd_net -net sys_cpu_resetn [get_bd_pins resetn] [get_bd_pins i2c/s_axi_aresetn] [get_bd_pins video_out/s_axi_aresetn]
connect_bd_net -net axi_hdmi_dma_mm2s_introut [get_bd_pins video_out/mm2s_introut] [get_bd_pins mm2s_introut]
connect_bd_net -net sys_200m_clk [get_bd_pins clk_in1] [get_bd_pins video_out/clk]
connect_bd_net -net axi_hdmi_core_hdmi_out_clk [get_bd_pins video_out/hdmi_out_clk] [get_bd_pins hdmi_out_clk]
connect_bd_net -net axi_hdmi_core_hdmi_16_hsync [get_bd_pins video_out/hdmi_16_hsync] [get_bd_pins hdmi_16_hsync]
connect_bd_net -net axi_hdmi_core_hdmi_16_vsync [get_bd_pins video_out/hdmi_16_vsync] [get_bd_pins hdmi_16_vsync]
connect_bd_net -net axi_hdmi_core_hdmi_16_data_e [get_bd_pins video_out/hdmi_16_data_e] [get_bd_pins hdmi_16_data_e]
connect_bd_net -net axi_hdmi_core_hdmi_16_data [get_bd_pins video_out/hdmi_16_data] [get_bd_pins hdmi_16_data]
connect_bd_net -net axi_iic_main_iic2intc_irpt [get_bd_pins i2c/iic2intc_irpt] [get_bd_pins iic2intc_irpt]
connect_bd_net -net sys_i2c_mixer_downstream_scl_T [get_bd_pins i2c/downstream_scl_T] [get_bd_pins downstream_scl_T]
connect_bd_net -net iic_mux_scl_i_1 [get_bd_pins downstream_scl_I] [get_bd_pins i2c/downstream_scl_I]
connect_bd_net -net sys_i2c_mixer_downstream_scl_O [get_bd_pins i2c/downstream_scl_O] [get_bd_pins downstream_scl_O]
connect_bd_net -net sys_i2c_mixer_downstream_sda_T [get_bd_pins i2c/downstream_sda_T] [get_bd_pins downstream_sda_T]
connect_bd_net -net iic_mux_sda_i_1 [get_bd_pins downstream_sda_I] [get_bd_pins i2c/downstream_sda_I]
connect_bd_net -net sys_i2c_mixer_downstream_sda_O [get_bd_pins i2c/downstream_sda_O] [get_bd_pins downstream_sda_O]
connect_bd_net -net axi_iic_fmc_iic2intc_irpt [get_bd_pins i2c/iic2intc_irpt1] [get_bd_pins iic2intc_irpt1]

current_bd_instance /hdmi/video_out
connect_bd_intf_net -intf_net axi_cpu_interconnect_M02_AXI [get_bd_intf_pins S_AXI_LITE] [get_bd_intf_pins axi_hdmi_dma/S_AXI_LITE]
connect_bd_intf_net -intf_net S00_AXI_2 [get_bd_intf_pins M_AXI_MM2S] [get_bd_intf_pins axi_hdmi_dma/M_AXI_MM2S]
connect_bd_intf_net -intf_net axi_cpu_interconnect_M01_AXI [get_bd_intf_pins s_axi] [get_bd_intf_pins axi_hdmi_clkgen/s_axi]
connect_bd_intf_net -intf_net axi_cpu_interconnect_M03_AXI [get_bd_intf_pins s_axi1] [get_bd_intf_pins axi_hdmi_core/s_axi]
connect_bd_net [get_bd_pins axi_hdmi_core/vdma_fs] [get_bd_pins axi_hdmi_dma/mm2s_fsync] [get_bd_pins axi_hdmi_core/vdma_fs_ret]
connect_bd_net [get_bd_pins axi_hdmi_dma/m_axis_mm2s_tdata] [get_bd_pins axi_hdmi_core/vdma_data]
connect_bd_net [get_bd_pins axi_hdmi_dma/m_axis_mm2s_tvalid] [get_bd_pins axi_hdmi_core/vdma_valid]
connect_bd_net [get_bd_pins axi_hdmi_core/vdma_ready] [get_bd_pins axi_hdmi_dma/m_axis_mm2s_tready]
connect_bd_net [get_bd_pins axi_hdmi_clkgen/clk_0] [get_bd_pins axi_hdmi_core/hdmi_clk]
connect_bd_net -net sys_cpu_clk [get_bd_pins vdma_clk] \
  [get_bd_pins axi_hdmi_core/vdma_clk] [get_bd_pins axi_hdmi_dma/m_axis_mm2s_aclk] [get_bd_pins axi_hdmi_clkgen/s_axi_aclk] \
  [get_bd_pins axi_hdmi_core/s_axi_aclk] [get_bd_pins axi_hdmi_dma/m_axi_mm2s_aclk] \
  [get_bd_pins axi_hdmi_dma/s_axi_lite_aclk]
connect_bd_net -net sys_cpu_resetn [get_bd_pins s_axi_aresetn] \
  [get_bd_pins axi_hdmi_clkgen/s_axi_aresetn] [get_bd_pins axi_hdmi_core/s_axi_aresetn] [get_bd_pins axi_hdmi_dma/axi_resetn]
connect_bd_net [get_bd_pins axi_hdmi_dma/mm2s_introut] [get_bd_pins mm2s_introut]
connect_bd_net -net sys_200m_clk [get_bd_pins clk] [get_bd_pins axi_hdmi_clkgen/clk]
connect_bd_net [get_bd_pins axi_hdmi_core/hdmi_out_clk] [get_bd_pins hdmi_out_clk]
connect_bd_net [get_bd_pins axi_hdmi_core/hdmi_16_hsync] [get_bd_pins hdmi_16_hsync]
connect_bd_net [get_bd_pins axi_hdmi_core/hdmi_16_vsync] [get_bd_pins hdmi_16_vsync]
connect_bd_net [get_bd_pins axi_hdmi_core/hdmi_16_data_e] [get_bd_pins hdmi_16_data_e]
connect_bd_net [get_bd_pins axi_hdmi_core/hdmi_16_data] [get_bd_pins hdmi_16_data]

current_bd_instance /hdmi/i2c
connect_bd_intf_net [get_bd_intf_pins axi_iic_main/IIC] [get_bd_intf_pins sys_i2c_mixer/upstream]
connect_bd_intf_net -intf_net axi_cpu_interconnect_M00_AXI [get_bd_intf_pins S_AXI] [get_bd_intf_pins axi_iic_main/S_AXI]
connect_bd_intf_net -intf_net axi_cpu_interconnect_M06_AXI [get_bd_intf_pins S_AXI1] [get_bd_intf_pins axi_iic_fmc/S_AXI]
connect_bd_intf_net [get_bd_intf_pins IIC] [get_bd_intf_pins axi_iic_fmc/IIC]
connect_bd_net -net sys_cpu_clk [get_bd_pins s_axi_aclk] [get_bd_pins axi_iic_fmc/s_axi_aclk] [get_bd_pins axi_iic_main/s_axi_aclk]
connect_bd_net -net sys_cpu_resetn [get_bd_pins s_axi_aresetn] [get_bd_pins axi_iic_fmc/s_axi_aresetn] [get_bd_pins axi_iic_main/s_axi_aresetn]
connect_bd_net [get_bd_pins axi_iic_main/iic2intc_irpt] [get_bd_pins iic2intc_irpt]
connect_bd_net [get_bd_pins sys_i2c_mixer/downstream_scl_T] [get_bd_pins downstream_scl_T]
connect_bd_net -net iic_mux_scl_i_1 [get_bd_pins downstream_scl_I] [get_bd_pins sys_i2c_mixer/downstream_scl_I]
connect_bd_net [get_bd_pins sys_i2c_mixer/downstream_scl_O] [get_bd_pins downstream_scl_O]
connect_bd_net [get_bd_pins sys_i2c_mixer/downstream_sda_T] [get_bd_pins downstream_sda_T]
connect_bd_net -net iic_mux_sda_i_1 [get_bd_pins downstream_sda_I] [get_bd_pins sys_i2c_mixer/downstream_sda_I]
connect_bd_net [get_bd_pins sys_i2c_mixer/downstream_sda_O] [get_bd_pins downstream_sda_O]
connect_bd_net [get_bd_pins axi_iic_fmc/iic2intc_irpt] [get_bd_pins iic2intc_irpt1]

current_bd_instance /
connect_bd_intf_net [get_bd_intf_pins axi_interconnect/S00_AXI1] [get_bd_intf_pins sys_ps7/M_AXI_GP0]
connect_bd_intf_net -intf_net axi_cpu_interconnect_M00_AXI [get_bd_intf_pins axi_interconnect/M00_AXI2] [get_bd_intf_pins hdmi/S_AXI2]
connect_bd_intf_net -intf_net axi_cpu_interconnect_M01_AXI [get_bd_intf_pins axi_interconnect/M01_AXI] [get_bd_intf_pins hdmi/s_axi]
connect_bd_intf_net -intf_net axi_cpu_interconnect_M02_AXI [get_bd_intf_pins axi_interconnect/M02_AXI] [get_bd_intf_pins hdmi/S_AXI_LITE]
connect_bd_intf_net -intf_net axi_cpu_interconnect_M03_AXI [get_bd_intf_pins axi_interconnect/M03_AXI] [get_bd_intf_pins hdmi/s_axi1]
connect_bd_intf_net -intf_net axi_cpu_interconnect_M06_AXI [get_bd_intf_pins axi_interconnect/M06_AXI] [get_bd_intf_pins hdmi/S_AXI3]
connect_bd_intf_net -intf_net axi_hp0_interconnect_M00_AXI [get_bd_intf_pins axi_interconnect/M00_AXI] [get_bd_intf_pins sys_ps7/S_AXI_HP0]
connect_bd_intf_net [get_bd_intf_pins axi_interconnect/S00_AXI] [get_bd_intf_pins hdmi/M_AXI_MM2S]
connect_bd_intf_net -intf_net axi_mem_intercon_M00_AXI [get_bd_intf_pins axi_interconnect/M00_AXI1] [get_bd_intf_pins sys_ps7/S_AXI_HP1]
connect_bd_intf_net -intf_net axi_cpu_interconnect_M09_AXI [get_bd_intf_pins axi_interconnect/M09_AXI] [get_bd_intf_pins image_processing/s_axi_CONTROL_BUS]
connect_bd_intf_net -intf_net axi_cpu_interconnect_M10_AXI [get_bd_intf_pins axi_interconnect/M10_AXI] [get_bd_intf_pins image_processing/S_AXI_LITE]
connect_bd_intf_net -intf_net axi_vdma_0_M_AXI_MM2S [get_bd_intf_pins image_processing/M_AXI_MM2S] [get_bd_intf_pins axi_interconnect/S01_AXI1]
connect_bd_intf_net -intf_net axi_vdma_0_M_AXI_S2MM [get_bd_intf_pins image_processing/M_AXI_S2MM] [get_bd_intf_pins axi_interconnect/S02_AXI]
connect_bd_intf_net [get_bd_intf_pins axi_interconnect/M05_AXI] [get_bd_intf_pins image_processing/s_axi_CONTROL_BUS3]
connect_bd_intf_net [get_bd_intf_pins axi_interconnect/M04_AXI] [get_bd_intf_pins image_processing/S_AXI_LITE1]
connect_bd_intf_net [get_bd_intf_pins image_processing/M_AXI_MM2S2] [get_bd_intf_pins axi_interconnect/S01_AXI]
connect_bd_intf_net [get_bd_intf_pins image_processing/M_AXI_S2MM1] [get_bd_intf_pins axi_interconnect/S02_AXI1]
connect_bd_intf_net [get_bd_intf_pins axi_interconnect/M07_AXI] [get_bd_intf_pins image_processing/S_AXI_LITE2]
connect_bd_intf_net [get_bd_intf_pins image_processing/M_AXI_MM2S1] [get_bd_intf_pins axi_interconnect/S03_AXI]
connect_bd_intf_net [get_bd_intf_pins axi_interconnect/M08_AXI] [get_bd_intf_pins image_processing/s_axi_CONTROL_BUS1]
connect_bd_intf_net [get_bd_intf_ports ddr] [get_bd_intf_pins sys_ps7/DDR]
connect_bd_intf_net [get_bd_intf_ports fixed_io] [get_bd_intf_pins sys_ps7/FIXED_IO]
connect_bd_intf_net -intf_net axi_iic_fmc_IIC [get_bd_intf_ports iic_fmc] [get_bd_intf_pins hdmi/IIC]
connect_bd_net -net sys_cpu_clk [get_bd_pins sys_ps7/FCLK_CLK0] \
  [get_bd_pins sys_ps7/DMA0_ACLK] [get_bd_pins sys_ps7/DMA1_ACLK] [get_bd_pins sys_ps7/DMA2_ACLK] \
  [get_bd_pins sys_ps7/M_AXI_GP0_ACLK] [get_bd_pins sys_ps7/S_AXI_HP0_ACLK] [get_bd_pins sys_ps7/S_AXI_HP1_ACLK] \
  [get_bd_pins image_processing/ap_clk] [get_bd_pins axi_interconnect/ACLK] [get_bd_pins irq_reset/slowest_sync_clk] \
  [get_bd_pins hdmi/S_AXI_ACLK]
connect_bd_net -net sys_200m_clk [get_bd_pins sys_ps7/FCLK_CLK1] [get_bd_pins hdmi/clk_in1]
# net sys_cpu_reset has one end: irq_reset/peripheral_reset
connect_bd_net -net sys_cpu_resetn [get_bd_pins irq_reset/peripheral_aresetn] \
  [get_bd_pins image_processing/ap_rst_n] [get_bd_pins axi_interconnect/ARESETN] [get_bd_pins hdmi/resetn]
connect_bd_net [get_bd_pins sys_ps7/FCLK_RESET0_N] [get_bd_pins irq_reset/ext_reset_in]
connect_bd_net [get_bd_ports gpio_i] [get_bd_pins sys_ps7/GPIO_I]
connect_bd_net [get_bd_pins sys_ps7/GPIO_O] [get_bd_ports gpio_o]
connect_bd_net [get_bd_pins sys_ps7/GPIO_T] [get_bd_ports gpio_t]
connect_bd_net [get_bd_ports iic_mux_scl_i] [get_bd_pins hdmi/downstream_scl_I]
connect_bd_net -net sys_i2c_mixer_downstream_scl_O [get_bd_pins hdmi/downstream_scl_O] [get_bd_ports iic_mux_scl_o]
connect_bd_net -net sys_i2c_mixer_downstream_scl_T [get_bd_pins hdmi/downstream_scl_T] [get_bd_ports iic_mux_scl_t]
connect_bd_net [get_bd_ports iic_mux_sda_i] [get_bd_pins hdmi/downstream_sda_I]
connect_bd_net -net sys_i2c_mixer_downstream_sda_O [get_bd_pins hdmi/downstream_sda_O] [get_bd_ports iic_mux_sda_o]
connect_bd_net -net sys_i2c_mixer_downstream_sda_T [get_bd_pins hdmi/downstream_sda_T] [get_bd_ports iic_mux_sda_t]
connect_bd_net -net sys_logic_inv_Res [get_bd_pins irq_reset/Res] [get_bd_pins sys_ps7/USB0_VBUS_PWRFAULT]
connect_bd_net [get_bd_ports otg_vbusoc] [get_bd_pins irq_reset/Op1]
connect_bd_net [get_bd_pins sys_ps7/SPI0_SS2_O] [get_bd_ports spi0_csn_2_o]
connect_bd_net [get_bd_pins sys_ps7/SPI0_SS1_O] [get_bd_ports spi0_csn_1_o]
connect_bd_net [get_bd_pins sys_ps7/SPI0_SS_O] [get_bd_ports spi0_csn_0_o]
connect_bd_net [get_bd_ports spi0_csn_i] [get_bd_pins sys_ps7/SPI0_SS_I]
connect_bd_net [get_bd_ports spi0_clk_i] [get_bd_pins sys_ps7/SPI0_SCLK_I]
connect_bd_net [get_bd_pins sys_ps7/SPI0_SCLK_O] [get_bd_ports spi0_clk_o]
connect_bd_net [get_bd_ports spi0_sdo_i] [get_bd_pins sys_ps7/SPI0_MOSI_I]
connect_bd_net [get_bd_pins sys_ps7/SPI0_MOSI_O] [get_bd_ports spi0_sdo_o]
connect_bd_net [get_bd_ports spi0_sdi_i] [get_bd_pins sys_ps7/SPI0_MISO_I]
connect_bd_net [get_bd_pins sys_ps7/SPI1_SS2_O] [get_bd_ports spi1_csn_2_o]
connect_bd_net [get_bd_pins sys_ps7/SPI1_SS1_O] [get_bd_ports spi1_csn_1_o]
connect_bd_net [get_bd_pins sys_ps7/SPI1_SS_O] [get_bd_ports spi1_csn_0_o]
connect_bd_net [get_bd_ports spi1_csn_i] [get_bd_pins sys_ps7/SPI1_SS_I]
connect_bd_net [get_bd_ports spi1_clk_i] [get_bd_pins sys_ps7/SPI1_SCLK_I]
connect_bd_net [get_bd_pins sys_ps7/SPI1_SCLK_O] [get_bd_ports spi1_clk_o]
connect_bd_net [get_bd_ports spi1_sdo_i] [get_bd_pins sys_ps7/SPI1_MOSI_I]
connect_bd_net [get_bd_pins sys_ps7/SPI1_MOSI_O] [get_bd_ports spi1_sdo_o]
connect_bd_net [get_bd_ports spi1_sdi_i] [get_bd_pins sys_ps7/SPI1_MISO_I]
connect_bd_net -net axi_hdmi_core_hdmi_out_clk [get_bd_pins hdmi/hdmi_out_clk] [get_bd_ports hdmi_out_clk]
connect_bd_net -net axi_hdmi_core_hdmi_16_hsync [get_bd_pins hdmi/hdmi_16_hsync] [get_bd_ports hdmi_hsync]
connect_bd_net -net axi_hdmi_core_hdmi_16_vsync [get_bd_pins hdmi/hdmi_16_vsync] [get_bd_ports hdmi_vsync]
connect_bd_net -net axi_hdmi_core_hdmi_16_data_e [get_bd_pins hdmi/hdmi_16_data_e] [get_bd_ports hdmi_data_e]
connect_bd_net -net axi_hdmi_core_hdmi_16_data [get_bd_pins hdmi/hdmi_16_data] [get_bd_ports hdmi_data]
# net axi_spdif_tx_core_spdif_tx_o has one end: spdif
connect_bd_net -net sys_concat_intc_dout [get_bd_pins irq_reset/dout] [get_bd_pins sys_ps7/IRQ_F2P]
connect_bd_net -net axi_hdmi_dma_mm2s_introut [get_bd_pins hdmi/mm2s_introut] [get_bd_pins irq_reset/In15]
connect_bd_net -net axi_iic_main_iic2intc_irpt [get_bd_pins hdmi/iic2intc_irpt] [get_bd_pins irq_reset/In14]
connect_bd_net -net ps_intr_12_1 [get_bd_ports ps_intr_12] [get_bd_pins irq_reset/In12] [get_bd_pins irq_reset/In13]
connect_bd_net -net axi_iic_fmc_iic2intc_irpt [get_bd_pins hdmi/iic2intc_irpt1] [get_bd_pins irq_reset/In11]
connect_bd_net -net ps_intr_07_1 [get_bd_ports ps_intr_07] [get_bd_pins irq_reset/In7]
connect_bd_net -net ps_intr_06_1 [get_bd_ports ps_intr_06] [get_bd_pins irq_reset/In6]
connect_bd_net -net ps_intr_05_1 [get_bd_ports ps_intr_05] [get_bd_pins irq_reset/In5]
connect_bd_net -net ps_intr_04_1 [get_bd_ports ps_intr_04] [get_bd_pins irq_reset/In4]
connect_bd_net -net sys_rstgen_interconnect_aresetn [get_bd_pins irq_reset/interconnect_aresetn] [get_bd_pins axi_interconnect/ARESETN1]
connect_bd_net -net morphological_filter_0_interrupt [get_bd_pins image_processing/morph_filter_irq] [get_bd_pins irq_reset/In8]
connect_bd_net -net axi_vdma_0_mm2s_introut [get_bd_pins image_processing/mp_dma_mm2s_irq] [get_bd_pins irq_reset/In10]
connect_bd_net -net axi_vdma_0_s2mm_introut [get_bd_pins image_processing/mp_dma_s2mm_irq] [get_bd_pins irq_reset/In9]
connect_bd_net [get_bd_pins irq_reset/peripheral_aresetn1] [get_bd_pins axi_interconnect/M11_ARESETN]
connect_bd_net [get_bd_pins irq_reset/peripheral_aresetn2] [get_bd_pins axi_interconnect/M12_ARESETN]
connect_bd_net [get_bd_pins irq_reset/peripheral_aresetn3] [get_bd_pins axi_interconnect/S03_ARESETN]
connect_bd_net [get_bd_pins irq_reset/peripheral_aresetn4] [get_bd_pins axi_interconnect/M13_ARESETN]
connect_bd_net [get_bd_pins irq_reset/peripheral_aresetn5] [get_bd_pins axi_interconnect/S04_ARESETN]
connect_bd_net [get_bd_pins irq_reset/peripheral_aresetn6] [get_bd_pins axi_interconnect/S05_ARESETN]
connect_bd_net [get_bd_pins irq_reset/peripheral_aresetn7] [get_bd_pins axi_interconnect/M14_ARESETN]
connect_bd_net [get_bd_pins irq_reset/peripheral_aresetn8] [get_bd_pins axi_interconnect/S06_ARESETN]
connect_bd_net -net In1_1 [get_bd_pins image_processing/stereo_matcher_irq] [get_bd_pins irq_reset/In1]
connect_bd_net -net In0_1 [get_bd_pins image_processing/sm_dma_mm2s_right_tx_irq] [get_bd_pins irq_reset/In0]
connect_bd_net -net In3_1 [get_bd_pins image_processing/sm_dma_s2mm_rx_irq] [get_bd_pins irq_reset/In3]
connect_bd_net -net In2_1 [get_bd_pins image_processing/sm_dma_mm2s_left_tx_irq] [get_bd_pins irq_reset/In2]
connect_bd_net [get_bd_pins irq_reset/peripheral_aresetn10] [get_bd_pins image_processing/ap_rst_n2]
connect_bd_net [get_bd_pins irq_reset/peripheral_aresetn14] [get_bd_pins axi_interconnect/S07_ARESETN]
# net irq_reset_peripheral_aresetn15 has one end: irq_reset/peripheral_aresetn15
connect_bd_net [get_bd_pins irq_reset/peripheral_aresetn16] [get_bd_pins axi_interconnect/M15_ARESETN]
connect_bd_net [get_bd_pins irq_reset/peripheral_aresetn9] [get_bd_pins image_processing/axi_resetn]
connect_bd_net [get_bd_pins irq_reset/peripheral_aresetn11] [get_bd_pins image_processing/axi_resetn1]
connect_bd_net [get_bd_pins irq_reset/peripheral_aresetn12] [get_bd_pins image_processing/ap_rst_n1]

# ---- address map ----
assign_bd_address -offset 0x00000000 -range 512M -target_address_space [get_bd_addr_spaces hdmi/video_out/axi_hdmi_dma/Data_MM2S] [get_bd_addr_segs sys_ps7/S_AXI_HP0/HP0_DDR_LOWOCM]
assign_bd_address -offset 0x00000000 -range 512M -target_address_space [get_bd_addr_spaces image_processing/mf_dma/Data_MM2S] [get_bd_addr_segs sys_ps7/S_AXI_HP1/HP1_DDR_LOWOCM]
assign_bd_address -offset 0x00000000 -range 512M -target_address_space [get_bd_addr_spaces image_processing/mf_dma/Data_S2MM] [get_bd_addr_segs sys_ps7/S_AXI_HP1/HP1_DDR_LOWOCM]
assign_bd_address -offset 0x00000000 -range 512M -target_address_space [get_bd_addr_spaces image_processing/sbm_vdma_left_out/Data_MM2S] [get_bd_addr_segs sys_ps7/S_AXI_HP0/HP0_DDR_LOWOCM]
assign_bd_address -offset 0x00000000 -range 512M -target_address_space [get_bd_addr_spaces image_processing/sbm_vdma_left_out/Data_S2MM] [get_bd_addr_segs sys_ps7/S_AXI_HP0/HP0_DDR_LOWOCM]
assign_bd_address -offset 0x00000000 -range 512M -target_address_space [get_bd_addr_spaces image_processing/sbm_vdma_right_in/Data_MM2S] [get_bd_addr_segs sys_ps7/S_AXI_HP0/HP0_DDR_LOWOCM]
assign_bd_address -offset 0x41600000 -range 4K -target_address_space [get_bd_addr_spaces sys_ps7/Data] [get_bd_addr_segs hdmi/i2c/axi_iic_main/S_AXI/Reg]
assign_bd_address -offset 0x41620000 -range 4K -target_address_space [get_bd_addr_spaces sys_ps7/Data] [get_bd_addr_segs hdmi/i2c/axi_iic_fmc/S_AXI/Reg]
assign_bd_address -offset 0x43000000 -range 64K -target_address_space [get_bd_addr_spaces sys_ps7/Data] [get_bd_addr_segs hdmi/video_out/axi_hdmi_dma/S_AXI_LITE/Reg]
assign_bd_address -offset 0x43010000 -range 64K -target_address_space [get_bd_addr_spaces sys_ps7/Data] [get_bd_addr_segs image_processing/mf_dma/S_AXI_LITE/Reg]
assign_bd_address -offset 0x43020000 -range 64K -target_address_space [get_bd_addr_spaces sys_ps7/Data] [get_bd_addr_segs image_processing/sbm_vdma_left_out/S_AXI_LITE/Reg]
assign_bd_address -offset 0x43030000 -range 64K -target_address_space [get_bd_addr_spaces sys_ps7/Data] [get_bd_addr_segs image_processing/sbm_vdma_right_in/S_AXI_LITE/Reg]
assign_bd_address -offset 0x43C00000 -range 64K -target_address_space [get_bd_addr_spaces sys_ps7/Data] [get_bd_addr_segs image_processing/stereo_matcher_1/s_axi_CONTROL_BUS/Reg]
assign_bd_address -offset 0x43C20000 -range 64K -target_address_space [get_bd_addr_spaces sys_ps7/Data] [get_bd_addr_segs image_processing/morphological_filter_0/s_axi_CONTROL_BUS/Reg]
assign_bd_address -offset 0x70E00000 -range 64K -target_address_space [get_bd_addr_spaces sys_ps7/Data] [get_bd_addr_segs hdmi/video_out/axi_hdmi_core/s_axi/axi_lite]
assign_bd_address -offset 0x79000000 -range 64K -target_address_space [get_bd_addr_spaces sys_ps7/Data] [get_bd_addr_segs hdmi/video_out/axi_hdmi_clkgen/s_axi/axi_lite]

validate_bd_design
save_bd_design
